# EAGLE schematic DS1338C_Breakout (EAGLE 6.4)
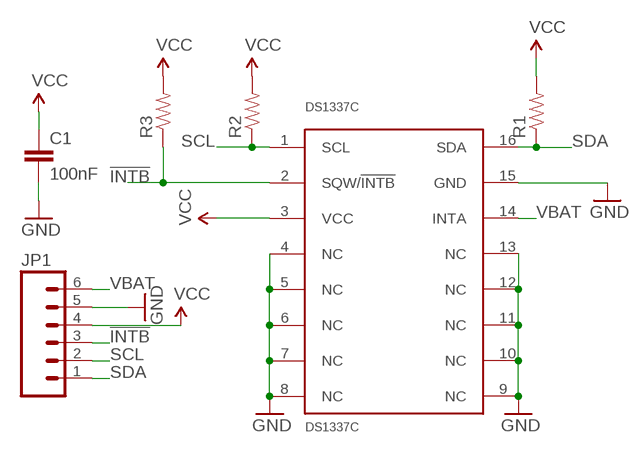
[diagram p0: schematic, sheet 1]

## Parts
C1  100nF  CAP0603-CAP  [0603-CAP]
DS1337C  DS1337C  [DS1337C]
JP1  M06SIP  [1X06]
R1  RESISTOR0603-RES  [0603-RES]
R2  RESISTOR0603-RES  [0603-RES]
R3  RESISTOR0603-RES  [0603-RES]

## Nets
!INTB: DS1337C.2(SQW/!INTB) JP1.3 R3.1
GND: C1.2 DS1337C.4(NC) DS1337C.5(NC) DS1337C.6(NC) DS1337C.7(NC) DS1337C.8(NC) DS1337C.9(NC) DS1337C.10(NC) DS1337C.11(NC) DS1337C.12(NC) DS1337C.13(NC) DS1337C.15(GND) JP1.5
SCL: DS1337C.1(SCL) JP1.2 R2.1
SDA: DS1337C.16(SDA) JP1.1 R1.1
VBAT: DS1337C.14(INTA) JP1.6
VCC: C1.1 DS1337C.3(VCC) JP1.4 R1.2 R2.2 R3.2

## Library data of the parts
C1 = SparkFun-Passives:CAP: Capacitor Standard 0603 ceramic capacitor, and 0.1" leaded capacitor.
DS1337C = DS1337C:DS1337C
JP1 = SparkFun-Connectors:M06: Header 6 Standard 6-pin 0.1" header. Use with straight break away headers (SKU : PRT-00116), right angle break away headers (PRT-00553), swiss pins (PRT-00743), machine pins (PRT-00117), and female headers (PRT-00115). Molex polarized connector foot print use with SKU : PRT-08094 with associated crimp pins and housings. NOTES ON THE VARIANTS LOCK and LOCK_LONGPADS... This footprint was designed to help hold the alignment of a through-hole component (i.e. 6-pin header) while soldering it into place. You may notice that each hole has been shifted either up or down by 0.005 of an inch from it's more standard position (which is a perfectly straight line). This slight alteration caused the pins (the squares in the middle) to touch the edges of the holes. Because they are alternating, it causes a "brace" to hold the component in place. 0.005 has proven to be the perfect amount of "off-center" position when using our standard breakaway headers. Although looks a little odd when you look at the bare footprint, once you have a header in there, the alteration is very hard to notice. Also, if you push a header all the way into place, it is covered up entirely on the bottom side. This idea of altering the position of holes to aid alignment will be further integrated into the Sparkfun Library for other footprints. It can help hold any component with 3 or more connection pins.
R1-R3 = SparkFun-Passives:RESISTOR: Resistor Basic schematic elements and footprints for 0603, 1206, and PTH resistors.